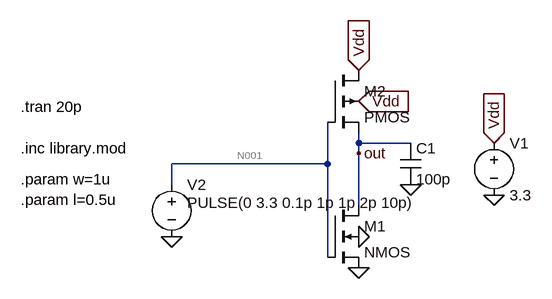
[diagram p0: schematic quiz3.asc]
quiz3.asc, the LTspice schematic file:
Version 4
SHEET 1 880 680
WIRE 288 80 288 64
WIRE 368 80 288 80
WIRE 288 96 288 80
WIRE 240 112 240 48
WIRE 240 112 0 112
WIRE 0 144 0 112
WIRE 288 176 288 96
WIRE 240 256 240 112
FLAG 496 80 Vdd
IOPIN 496 80 In
FLAG 288 16 Vdd
IOPIN 288 16 In
FLAG 288 -32 Vdd
IOPIN 288 -32 In
FLAG 496 160 0
FLAG 288 224 0
FLAG 0 224 0
FLAG 288 96 out
FLAG 288 272 0
FLAG 368 144 0
SYMBOL voltage 0 128 R0
WINDOW 3 24 44 Left 2
WINDOW 123 0 0 Left 0
WINDOW 39 0 0 Left 0
SYMATTR Value PULSE(0 3.3 0.1p 1p 1p 2p 10p)
SYMATTR InstName V2
SYMBOL voltage 496 64 R0
WINDOW 123 0 0 Left 0
WINDOW 39 0 0 Left 0
SYMATTR InstName V1
SYMATTR Value 3.3
SYMBOL nmos4 240 176 R0
SYMATTR InstName M1
SYMATTR Value2 l=w w=l
SYMBOL pmos4 240 -32 R0
SYMATTR InstName M2
SYMATTR Value2 l=l w=w
SYMBOL cap 352 80 R0
SYMATTR InstName C1
SYMATTR Value 100p
TEXT -232 88 Left 2 !.inc library.mod
TEXT -232 136 Left 2 !.param w=1u\n.param l=0.5u
TEXT -232 24 Left 2 !.tran 20p

The netlist it stands for:
* quiz3.asc
V2 N001 0 PULSE(0 3.3 0.1p 1p 1p 2p 10p)
V1 Vdd 0 3.3
M1 out N001 0 0 NMOS l=w w=l
M2 Vdd N001 out Vdd PMOS l=l w=w
C1 out 0 100p
.model NMOS NMOS
.model PMOS PMOS
.lib standard.mos
.inc library.mod
.param w=1u
.param l=0.5u
.tran 20p
.backanno
.end

* Results of the author's LTspice run, read from the files saved beside the schematic
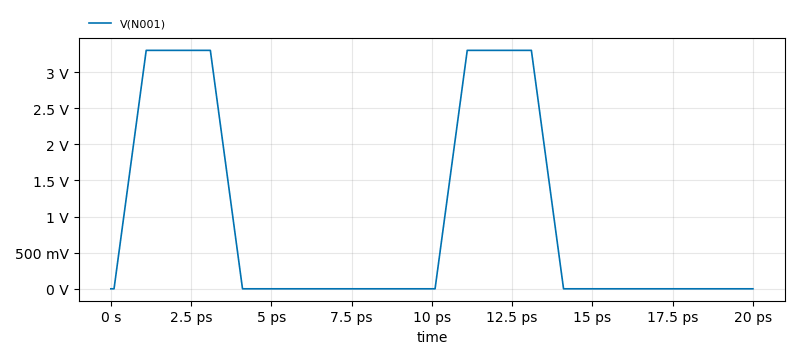
[diagram p1: Transient Analysis of quiz3.asc, plotted from the saved traces]
* Transient Analysis, 1 run:
*   V(N001): min 0 V, max 3.3 V, average 990 mV, rms 1.706 V, last 0 V